# EAGLE design nes_controller_v1.0 (EAGLE 8.5.0)
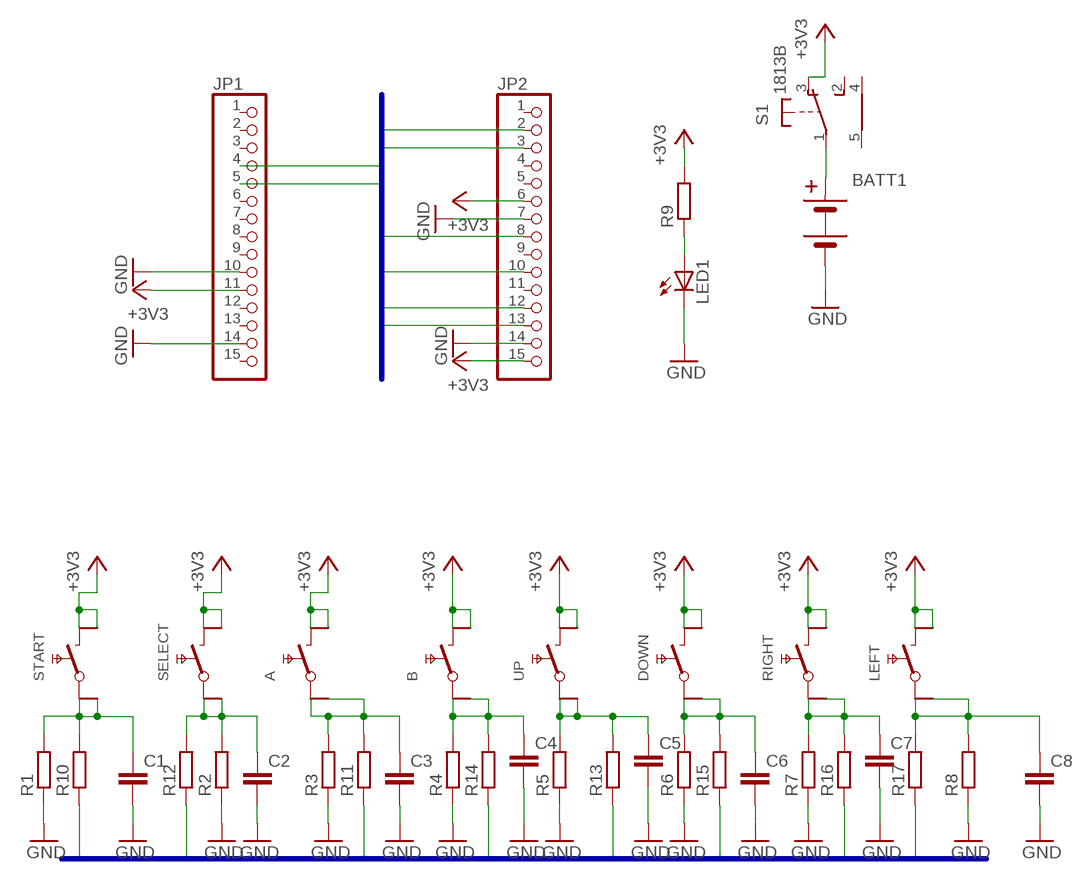
[diagram p0: schematic, sheet 1]

## Parts
A  SMDTAST  [SMDTAST]
B  SMDTAST  [SMDTAST]
BATT1  BATTERIEHALTER_2X_AAA  [BATTERIEHALTER]
C1  C-EUC0805K  [C0805K]
C2  C-EUC0805K  [C0805K]
C3  C-EUC0805K  [C0805K]
C4  C-EUC0805K  [C0805K]
C5  C-EUC0805K  [C0805K]
C6  C-EUC0805K  [C0805K]
C7  C-EUC0805K  [C0805K]
C8  C-EUC0805K  [C0805K]
DOWN  SMDTAST  [SMDTAST]
JP1  PINHD-1X15  [1X15]
JP2  PINHD-1X15  [1X15]
LED1  LED3MM  [LED3MM]
LEFT  SMDTAST  [SMDTAST]
R1  R-EU_R1206  [R1206]
R2  R-EU_R1206  [R1206]
R3  R-EU_R1206  [R1206]
R4  R-EU_R1206  [R1206]
R5  R-EU_R1206  [R1206]
R6  R-EU_R1206  [R1206]
R7  R-EU_R1206  [R1206]
R8  R-EU_R1206  [R1206]
R9  R-EU_R1206  [R1206]
R10  R-EU_R1206  [R1206]
R11  R-EU_R1206  [R1206]
R12  R-EU_R1206  [R1206]
R13  R-EU_R1206  [R1206]
R14  R-EU_R1206  [R1206]
R15  R-EU_R1206  [R1206]
R16  R-EU_R1206  [R1206]
R17  R-EU_R1206  [R1206]
RIGHT  SMDTAST  [SMDTAST]
S1  1813B  [1813B]
SELECT  SMDTAST  [SMDTAST]
START  SMDTAST  [SMDTAST]
UP  SMDTAST  [SMDTAST]

## Nets
3§4: C2.1 R2.2 R12.2 SELECT.1 SELECT.11
4$5: A.1 A.11 C3.1 R3.2 R11.2
+3V3: A.2 A.22 B.2 B.22 DOWN.2 DOWN.22 JP1.11 JP2.6 JP2.15 LEFT.2 LEFT.22 R9.2 RIGHT.2 RIGHT.22 S1.3(O) SELECT.2 SELECT.22 START.2 START.22 UP.2 UP.22
A: JP1.5 R11.1
B: JP1.4 R14.1
DOWN: JP2.10 R15.1
GND: BATT1.P- C1.2 C2.2 C3.2 C4.2 C5.2 C6.2 C7.2 C8.2 JP1.10 JP1.14 JP2.7 JP2.14 LED1.K(C) R1.1 R2.1 R3.1 R4.1 R5.1 R6.1 R7.1 R8.1
LEFT: JP2.3 R17.1
N$1: BATT1.P+ S1.1(W)
N$2: LED1.A R9.1
N$3: C1.1 R1.2 R10.2 START.1 START.11
N$4: B.1 B.11 C4.1 R4.2 R14.2
N$5: C5.1 R5.2 R13.2 UP.1 UP.11
N$6: C6.1 DOWN.1 DOWN.11 R6.2 R15.2
N$7: C7.1 R7.2 R16.2 RIGHT.1 RIGHT.11
N$8: C8.1 LEFT.1 LEFT.11 R8.2 R17.2
RIGHT: JP2.8 R16.1
SELECT: JP2.12 R12.1
START: JP2.13 R10.1
UP: JP2.2 R13.1
Unconnected: JP1.1 JP1.2 JP1.3 JP1.6 JP1.7 JP1.8 JP1.9 JP1.12 JP1.13 JP1.15 JP2.1 JP2.4 JP2.5 JP2.9 JP2.11 S1.2(S) S1.4(SH1) S1.5(SH2)

## Buses
SELECT,START,A,B,UP,DOWN,LEFT,RIGHT

## Library data of the parts
A B DOWN LEFT RIGHT SELECT START UP = Schalter-sh:SMDTAST
BATT1 = Taschenlampe:BATTERIEHALTER_2X_AAA: Batteriehalter 2x AAA, printbar
C1-C8 = rcl:C-EU: CAPACITOR, European symbol; SPICEPREFIX: C
JP1 JP2 = pinhead:PINHD-1X15: PIN HEADER
LED1 = led:LED: LED OSRAM: - CHIPLED LG R971, LG N971, LY N971, LG Q971, LY Q971, LO R971, LY R971 LH N974, LH R974 LS Q976, LO Q976, LY Q976 LO Q996 - Hyper CHIPLED LW Q18S LB Q993, LB Q99A, LB R99A - SideLED LS A670, LO A670, LY A670, LG A670, LP A670 LB A673, LV A673, LT A673, LW A673 LH A674 LY A675 LS A676, LA A676, LO A676, LY A676, LW A676 LS A679, LY A679, LG A679 - Hyper Micro SIDELED® LS Y876, LA Y876, LO Y876, LY Y876 LT Y87S - SmartLED LW L88C, LW L88S LB L89C, LB L89S, LG L890 LS L89K, LO L89K, LY L89K LS L896, LA L896, LO L896, LY L896 - TOPLED LS T670, LO T670, LY T670, LG T670, LP T670 LSG T670, LSP T670, LSY T670, LOP T670, LYG T670 LG T671, LOG T671, LSG T671 LB T673, LV T673, LT T673, LW T673 LH T674 LS T676, LA T676, LO T676, LY T676, LB T676, LH T676, LSB T676, LW T676 LB T67C, LV T67C, LT T67C, LS T67K, LO T67K, LY T67K, LW E67C LS E67B, LA E67B, LO E67B, LY E67B, LB E67C, LV E67C, LT E67C LW T67C LS T679, LY T679, LG T679 LS T770, LO T770, LY T770, LG T770, LP T770 LB T773, LV T773, LT T773, LW T773 LH T774 LS E675, LA E675, LY E675, LS T675 LS T776, LA T776, LO T776, LY T776, LB T776 LHGB T686 LT T68C, LB T68C - Hyper Mini TOPLED® LB M676 - Mini TOPLED Santana® LG M470 LS M47K, LO M47K, LY M47K Source: http://www.osram.convergy.de LUXEON: - LUMILED® LXK2-PW12-R00, LXK2-PW12-S00, LXK2-PW14-U00, LXK2-PW14-V00 LXK2-PM12-R00, LXK2-PM12-S00, LXK2-PM14-U00 LXK2-PE12-Q00, LXK2-PE12-R00, LXK2-PE12-S00, LXK2-PE14-T00, LXK2-PE14-U00 LXK2-PB12-K00, LXK2-PB12-L00, LXK2-PB12-M00, LXK2-PB14-N00, LXK2-PB14-P00, LXK2-PB14-Q00 LXK2-PR12-L00, LXK2-PR12-M00, LXK2-PR14-Q00, LXK2-PR14-R00 LXK2-PD12-Q00, LXK2-PD12-R00, LXK2-PD12-S00 LXK2-PH12-R00, LXK2-PH12-S00 LXK2-PL12-P00, LXK2-PL12-Q00, LXK2-PL12-R00 Source: www.luxeon.com KINGBRIGHT: KA-3528ASYC Source: www.kingbright.com
R1-R17 = rcl:R-EU_: RESISTOR, European symbol
S1 = Benutzer_WM:1813B

## Board
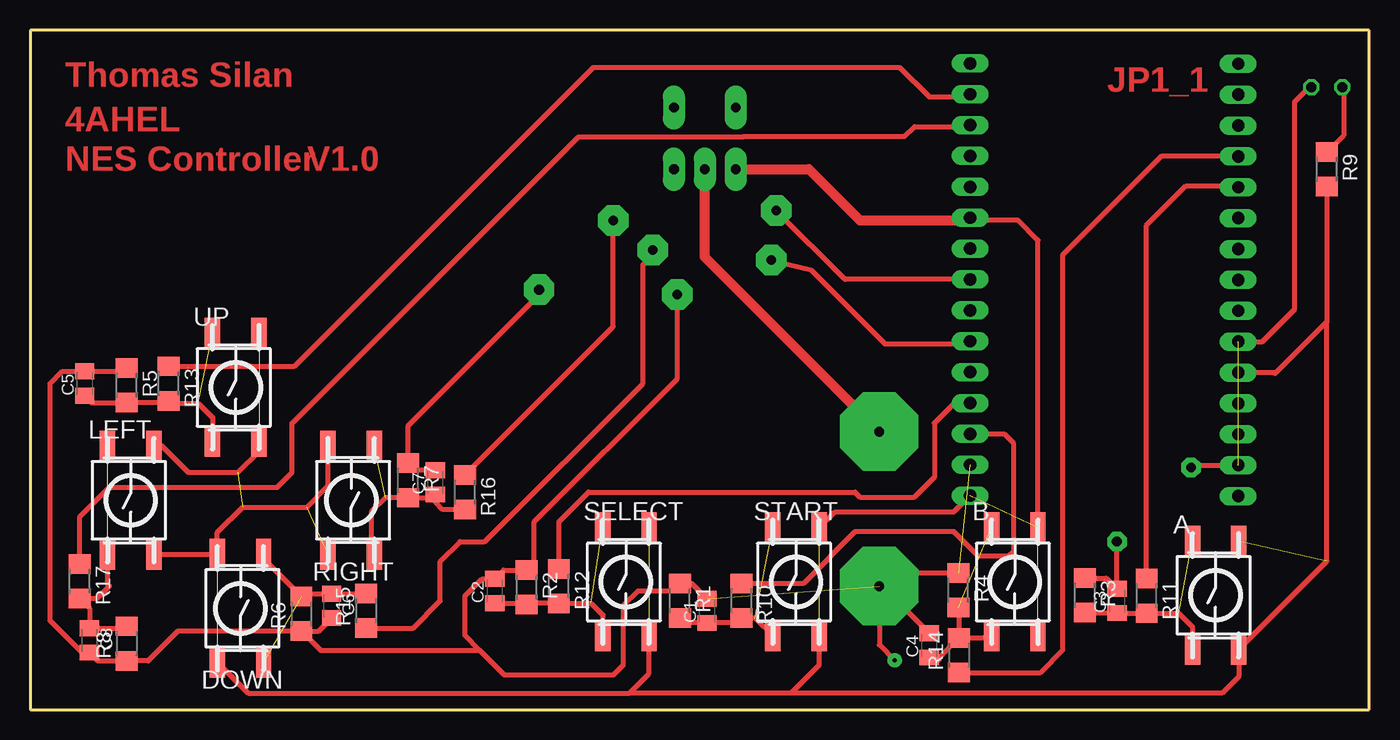
[diagram p1: board, top side]
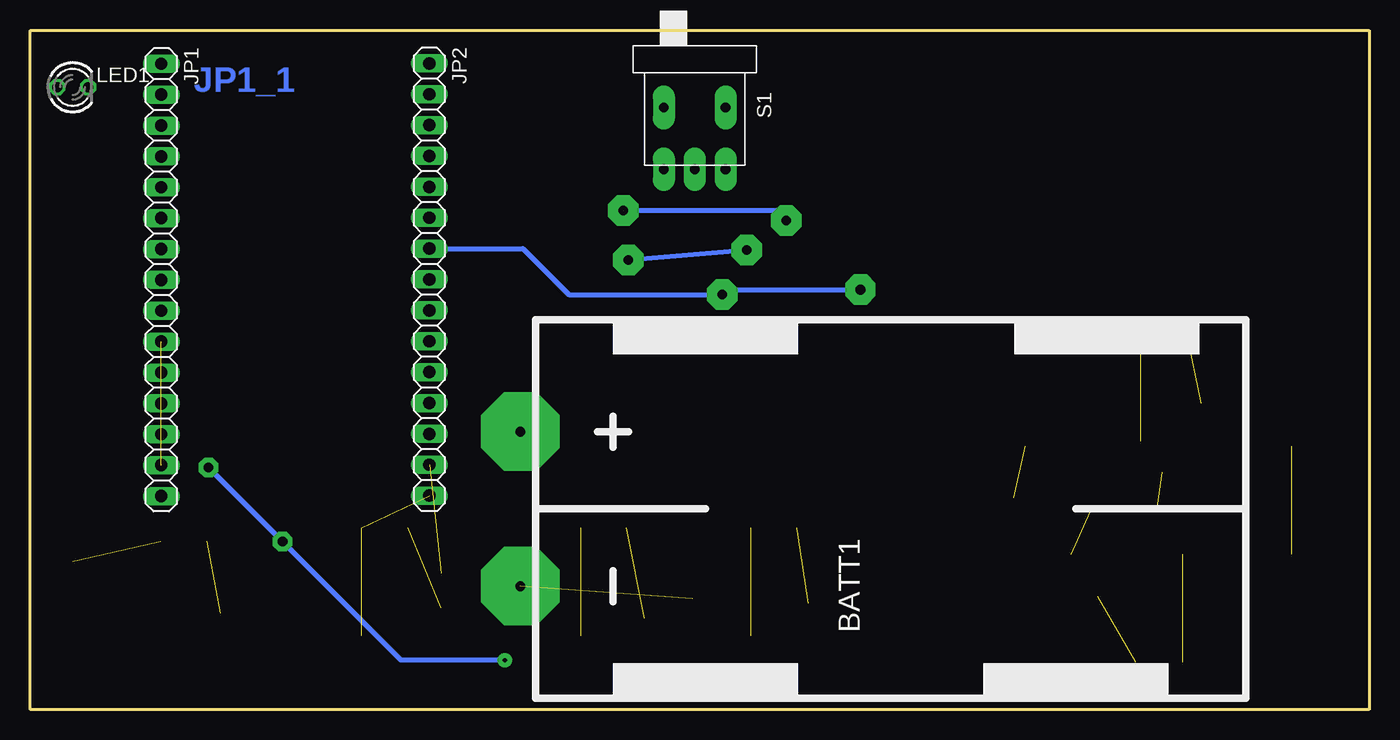
[diagram p2: board, bottom side, seen from below]

Size 110.16 x 55.87 mm. Coordinates in mm from the lower left corner, seen from the top.
Outline: 0,0 110.16,0 110.16,55.87 0,55.87 0,0
Copper layers (1*16): Top 0.035mm / dielectric 1.5mm / Bottom 0.035mm
Design rules "htl-klu": minimum track width 16mil, minimum drill 31mil, track to track 16mil, track to pad 16mil, pad to pad 16mil, via to via 16mil, smd to smd 12mil, copper to edge 40mil, drill to drill 16mil, minimum pad ring 10mil, minimum via ring 16mil, stop-mask expansion 4mil, vias tented up to drill 0mil, thermal gap 20mil

### Footprints (pad centres in the part's own frame; a part is rotated, then mirrored left to right if it is on the bottom)
SMDTAST = smd 1.27 x 2.54: 1 -1.905,-4.445; 2 1.905,-4.445; 11 -1.905,4.445; 22 1.905,4.445
BATTERIEHALTER = drill 0.813 pad 6.452 octagon: P+ 6.35,30.48; P- -6.35,30.48
C0805K = smd 1.3 x 1.6: 1 -1,0; 2 1,0
1X15 = drill 1.016 long: 1 -17.78,0; 2 -15.24,0; 3 -12.7,0; 4 -10.16,0; 5 -7.62,0; 6 -5.08,0; 7 -2.54,0; 8 0,0; 9 2.54,0; 10 5.08,0; 11 7.62,0; 12 10.16,0; 13 12.7,0; 14 15.24,0; 15 17.78,0
LED3MM = drill 0.813 octagon: A -1.27,0; K 1.27,0
R1206 = smd 1.6 x 1.803: 1 -1.422,0; 2 1.422,0
1813B = drill 0.8 pad 1.8 long: 1 0,0; 2 0,2.54; 3 0,-2.54; 4 -5.08,2.54; 5 -5.08,-2.54

### Placement (x,y rotation side)
A  97.52,9.41 0 top
B  81,10.5 0 top
BATT1  39.37,16.51 90 bottom
C1  55.68,8.13 90 top
C2  38.2,9.75 90 top
C3  89.41,8.94 90 top
C4  73.96,5.28 90 top
C5  4.47,26.82 90 top
C6  24.79,8.53 270 top
C7  33.32,18.69 90 top
C8  4.88,5.69 270 top
DOWN  17.29,8.33 180 top
JP1  99.39,35.35 270 bottom
JP2  77.33,35.38 270 bottom
LED1  106.68,51.2 0 bottom
LEFT  8.26,17.22 0 top
R1  53.44,8.94 270 top
R2  40.84,10.06 270 top
R3  86.77,9.4 270 top
R4  76.35,9.8 270 top
R5  7.92,26.67 270 top
R6  22.3,7.87 90 top
R7  31.09,18.85 270 top
R8  7.92,5.44 90 top
R9  106.68,44.45 270 top
R10  58.52,8.94 270 top
R11  91.85,9.35 270 top
R12  43.48,10.16 270 top
R13  11.38,26.82 270 top
R14  76.4,4.47 90 top
R15  27.64,8.13 90 top
R16  35.76,17.88 270 top
R17  4.06,10.57 270 top
RIGHT  26.4,17.22 180 top
S1  55.5,44.45 270 bottom
SELECT  49,10.5 0 top
START  63,10.5 0 top
UP  16.9,26.5 0 top

### Tracks (layer width: path | path; a pad name or v marks a point on that pad's centre or on a via)
3§4  (1 unrouted)
  Top 0.406: 40.95,8.74 R12.2 46.13,8.74 47.14,7.72 47.09,7.67 SELECT.1 | 40.95,8.74 R2.2 | C2.1 40.93,8.75 40.95,8.74
4$5  (1 unrouted)
  Top 0.406: R3.2 89.37,7.98 C3.1 91.83,7.94 R11.2 94.49,7.92 95.61,6.8 A.1
+3V3  (9 unrouted)
  Top 0.406: R9.2 106.68,31.9 | 106.68,31.9 102.41,27.64 102.32,27.73 JP1.11 | 106.68,31.9 106.68,12.22 A.2 99.42,2.7 98.07,1.35 62.59,1.35 | LEFT.2 DOWN.2 15.38,14.57 17.48,16.66 22.76,16.66 24.5,18.4 RIGHT.2 | SELECT.2 50.91,2.95 49.3,1.35 | START.2 64.91,3.67 62.59,1.35 | 62.59,1.35 49.3,1.35 | B.22 82.91,38.61 81.28,40.23 77.1,40.23 | START.22 66.22,16.26 75.99,16.26 JP2.15 | DOWN.22 17.92,1.35 49.3,1.35 | LEFT.22 10.85,21.66 13.01,19.51 17.07,19.51 18.8,21.24 UP.2
  Top 0.813: S1.3 64.06,44.45 68.28,40.23 77.1,40.23 JP2.6
A
  Top 0.406: R11.1 91.85,39.83 95.1,43.08 99.28,43.08 JP1.5
B
  Top 0.406: JP1.4 93.06,45.51 84.94,37.39 84.94,4.88 83.11,3.05 R14.1
DOWN  (via drill 0.8 pad 2.5)
  Top 0.406: R15.1 31.5,6.71 33.73,8.94 33.73,12.19 35.36,13.82 37.39,13.82 50.39,26.82 50.39,36.58 51.21,37.39 v51.21,37.8 | v60.96,36.98 64.21,36.17 70.31,30.07 77.1,30.07 JP2.10
  Bottom 0.406: v51.21,37.8 v60.96,36.98
GND  (via drill 0.35, 0.8, 0.8 pad 2.5)  (3 unrouted)
  Top 0.406: JP1.10 101.39,30.27 104.04,32.92 104.04,49.99 105.25,51.2 LED1.K | R6.1 23.71,6.45 C6.2 | R5.1 7.66,27.82 C5.2 2.63,27.82 1.63,26.82 1.63,7.32 4.25,4.69 C8.2 5.55,4.01 R8.1 9.7,4.01 12.14,6.45 R6.1 | C1.2 54.44,10.36 R1.1 52.83,9.75 49.99,9.75 48.77,8.53 48.77,3.66 47.95,2.85 39.01,2.85 36.98,4.88 | C4.2 70.2,10.05 | 70.2,10.05 70.09,10.16 BATT1.P- 69.85,5.33 v71.12,4.06 | R4.1 71.37,11.23 70.2,10.05 | R3.1 88.53,10.82 C3.2 v89.41,13.82 | v95.5,19.91 95.7,20.11 JP1.14 | C7.2 31.66,19.69 R7.1 31.09,23.37 41.86,34.14 v41.86,34.54 | v53.24,34.14 53.24,27.23 41.45,15.44 41.45,12.09 R2.1 38.93,11.48 C2.2 37.17,10.75 35.76,9.35 35.76,6.1 36.98,4.88 | R6.1 23.88,4.88 36.98,4.88
  Bottom 0.406: v95.5,19.91 v89.41,13.82 79.65,4.06 v71.12,4.06 | v41.86,34.54 52.83,34.54 v53.24,34.14 65.84,34.14 69.62,37.92 JP2.7
LEFT
  Top 0.406: JP2.3 77.2,47.95 72.75,47.95 71.93,47.14 58.69,47.14 58.66,47.12 45.09,47.12 21.54,23.57 21.54,19.51 20.32,18.29 6.5,18.29 4.06,15.85 R17.1
N$1
  Top 0.813: BATT1.P+ 55.5,37.21 S1.1
N$2
  Top 0.406: R9.1 108.1,47.29 108.1,51.05 LED1.A
N$3  (1 unrouted)
  Top 0.406: START.1 59.63,7.52 R10.2 58.13,7.13 C1.1 53.83,7.13 R1.2
N$4  (1 unrouted)
  Top 0.406: R4.2 76.4,8.33 R14.2 | B.1 78.68,6.05 78.52,5.89 R14.2 | 74.78,4.06 74.18,4.06 C4.1 74.79,4.28 R14.2
N$5  (1 unrouted)
  Top 0.406: C5.1 5.04,25.25 R5.2 11.23,25.25 R13.2 11.58,25.2 13.82,25.2 15.04,23.98 14.99,23.94 UP.1
N$6  (1 unrouted)
  Top 0.406: R15.2 27.62,9.53 C6.1 22.54,9.53 R6.2 19.2,12.4 DOWN.1
N$7  (1 unrouted)
  Top 0.406: R16.2 33.93,16.46 33.33,17.07 C7.1 33.05,17.43 R7.2 29.21,17.43 28.04,16.26 28.04,13.04 RIGHT.11
N$8  (1 unrouted)
  Top 0.406: R8.2 7.76,6.69 C8.1 4.88,8.33 R17.2 5.49,9.14 6.5,10.16 6.36,10.31 LEFT.1
RIGHT  (via drill 0.8 pad 2.5)  (1 unrouted)
  Top 0.406: R16.1 47.95,31.5 v47.95,40.23 | JP2.8 67.03,35.38 v61.37,41.05
  Bottom 0.406: v47.95,40.23 48.77,41.05 v61.37,41.05
SELECT
  Top 0.406: JP2.12 76.02,25.22 74.37,23.57 74.37,19.1 72.75,17.48 68.28,17.48 67.87,17.88 45.92,17.88 43.48,15.44 R12.1
START
  Top 0.406: JP2.13 80.14,22.68 80.87,21.95 80.87,13.01 80.47,12.6 78.03,12.6 76,14.63 67.87,14.63 63.6,10.36 R10.1
UP
  Top 0.406: R13.1 21.74,28.24 24.99,31.5 25.2,31.7 46.33,52.83 71.53,52.83 73.97,50.39 77.1,50.39 JP2.2

### Text on the board
Top: Thomas Silan | JP1_1 | 4AHEL | NES Controller | V1.0
Bottom: JP1_1